# Altium schematic sheet Pwm.schdoc
size A; Organization: Altium Limited; Address1: L3, 12a Rodborough Rd; Address2: Frenchs Forest; Address3: NSW; Address4: Australia 2086; DocumentNumber: 1; SheetNumber: 1; SheetTotal: 1
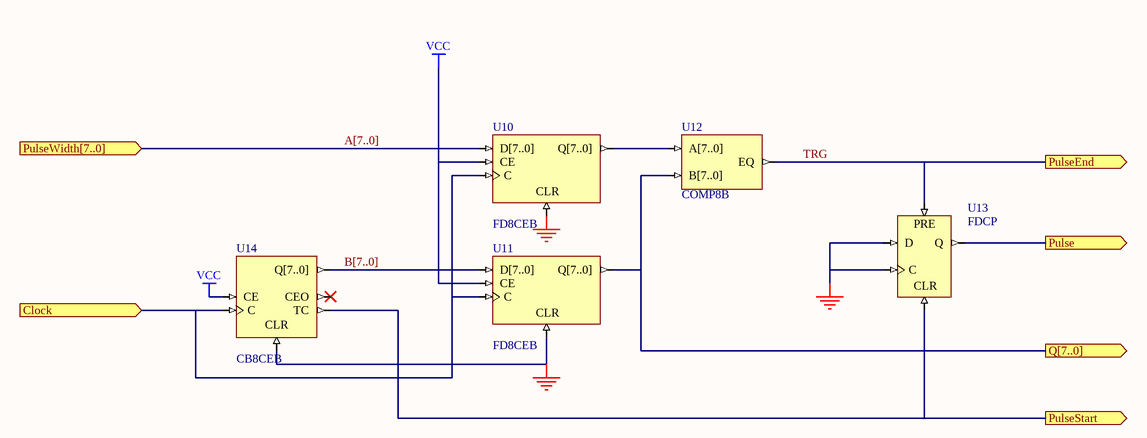
[diagram p0: Pwm.schdoc]

## Parts
U10  FD8CEB
U11  FD8CEB
U12  COMP8B
U13  FDCP
U14  CB8CEB

## Ports
Clock (in), Pulse (out), PulseEnd (out), PulseStart (out), PulseWidth[7..0] (in), Q[7..0] (out)

## Nets
GND: U10.CLR U11.CLR U13.C U13.D U14.CLR
VCC: U10.CE U11.CE U14.CE
A[7..0]: U10.D[7..0] ; port PulseWidth[7..0]
B[7..0]: U11.D[7..0] U14.Q[7..0]
Clock: U10.C U11.C U14.C ; port Clock
Pulse: U13.Q ; port Pulse
PulseStart: U13.CLR U14.TC ; port PulseStart
Q[7..0]: U11.Q[7..0] U12.B[7..0] ; port Q[7..0]
TRG: U12.EQ U13.PRE ; port PulseEnd
NetU10_Q[7..0]: U10.Q[7..0] U12.A[7..0]

Not connected (* = marked no-connect by the designer): U14 CEO*

## Buses and harness runs
bus A[7..0] = port PulseWidth[7..0]
bus B[7..0]

## Notes on the sheet
- Title
- Size:
- Date:
- A
- Number:
- Time:
- Revision:
- Sheet
- of
- File:

## Library data of the parts
U10 U11 = FD8CEB: 8-Bit D-Type Flip-Flop with Clock Enable and Asynchronous Clear, Bus Version; Xilinx Equivalent: FD8CE; ArchiveName: GENERIC; VHDLIB_SIM: GENERIC_LIB; Published: 29-Jan-2004; Publisher: Altium Limited; Core Revision: 1.00.00
U12 = COMP8B: 8-Bit Identity Comparator, Bus Version; Xilinx Equivalent: COMP8; ArchiveName: GENERIC; VHDLIB_SIM: GENERIC_LIB; Published: 29-Jan-2004; Publisher: Altium Limited; Core Revision: 1.00.00
U13 = FDCP: D-Type Flip-Flop with Asynchronous Preset and Clear; ArchiveName: GENERIC; VHDLIB_SIM: GENERIC_LIB; Published: 29-Jan-2004; Publisher: Altium Limited; Xilinx Equivalent: FDCP; Core Revision: 1.00.00
U14 = CB8CEB: 8-Bit Cascadable Binary Counters with Clock Enable and Asynchronous Clear, Bus Version; Xilinx Equivalent: CB8CE; ArchiveName: GENERIC; VHDLIB_SIM: GENERIC_LIB; Published: 29-Jan-2004; Publisher: Altium Limited; Core Revision: 1.00.00